# Altium schematic sheet bridge.SchDoc
size A2; SheetNumber: 2; SheetTotal: 5
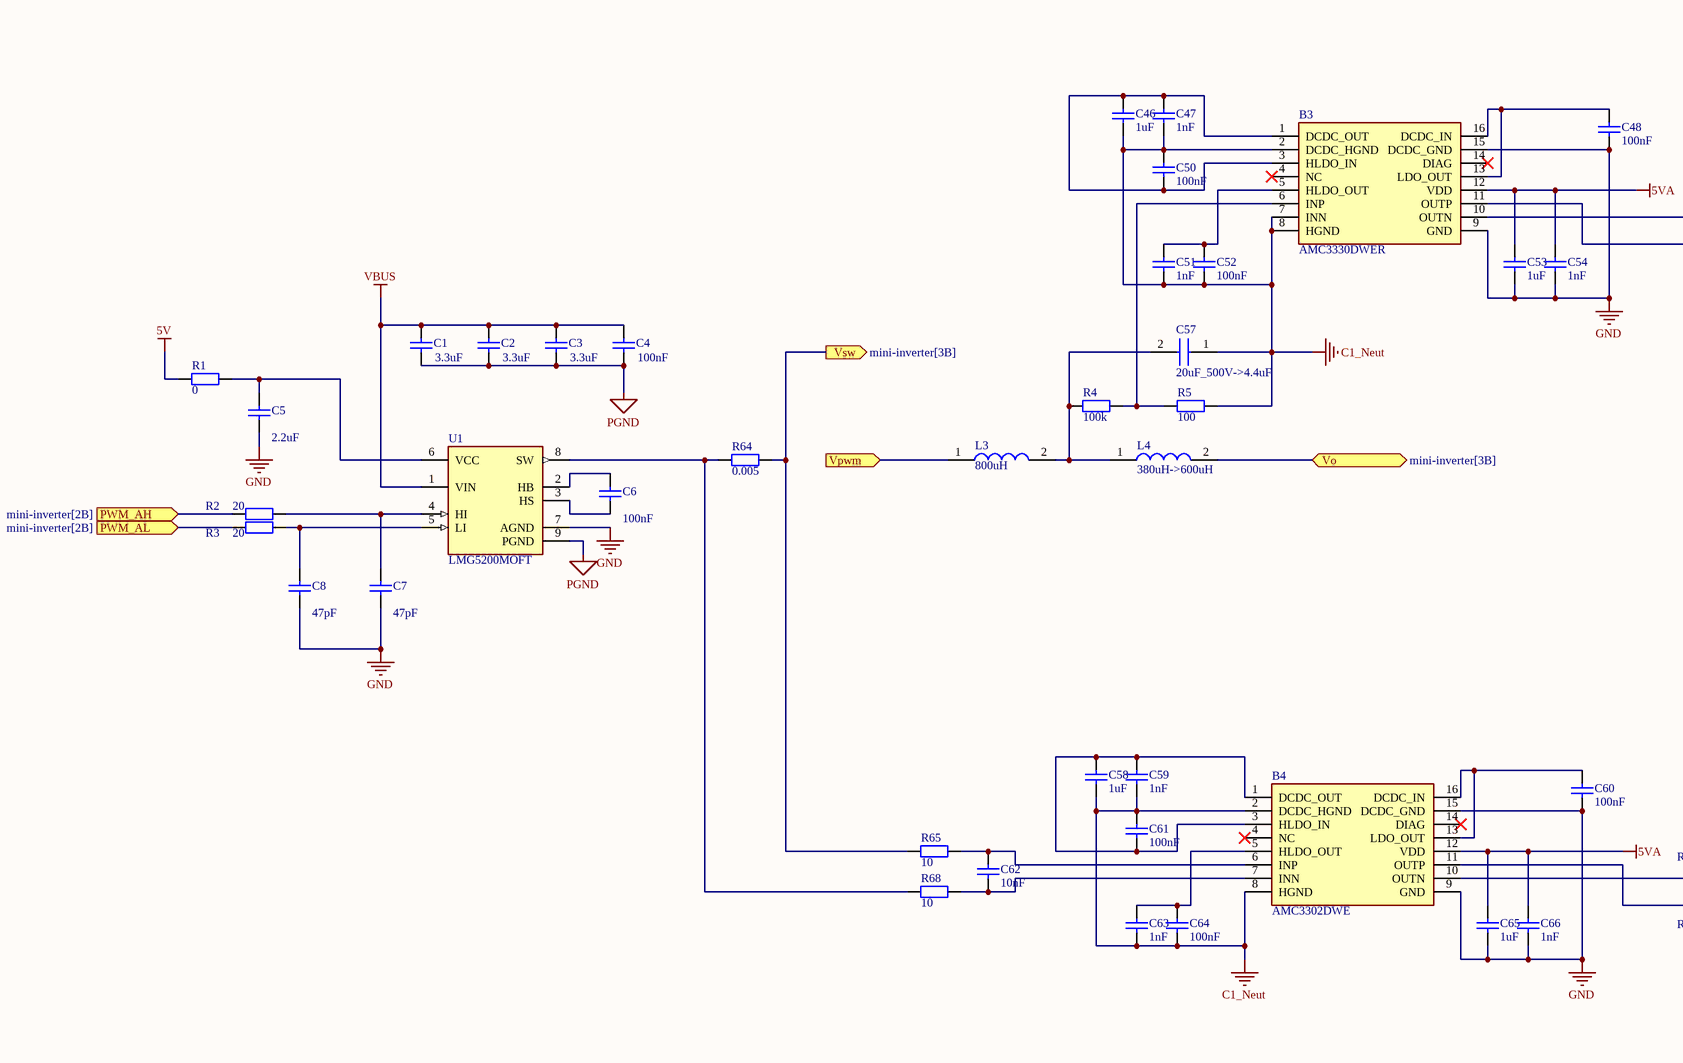
[diagram p0: bridge.SchDoc, left]
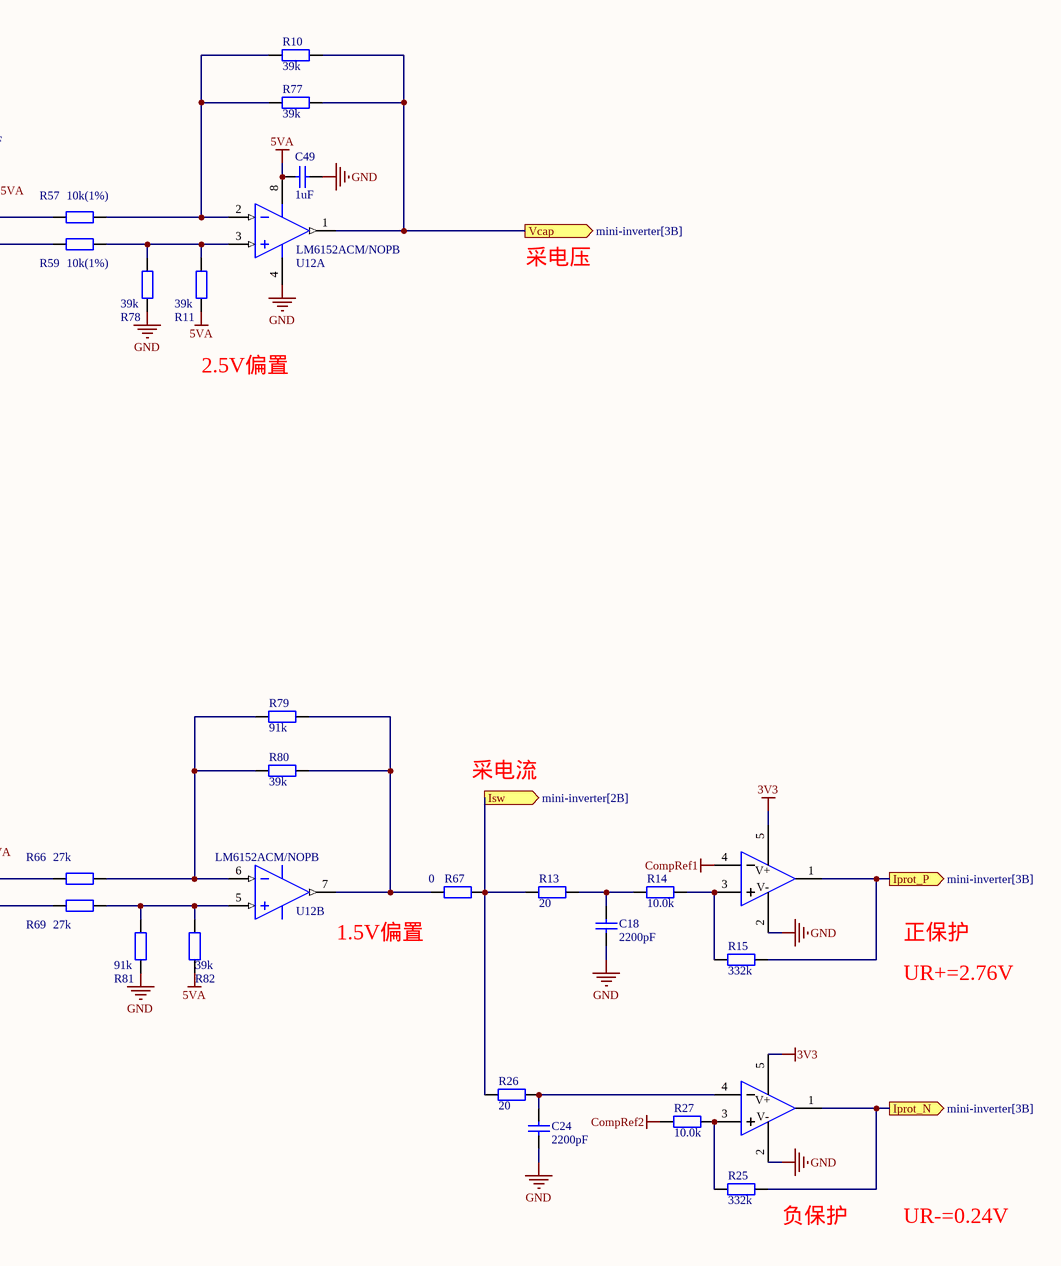
[diagram p1: bridge.SchDoc, right]

## Parts
B3  AMC3330DWER  [SOIC127P1030X265-16N]
B4  AMC3302DWE  [SOIC127P1030X265-16N]
C1  3.3uF  [CAPC1608X06N]
C2  3.3uF  [CAPC1608X06N]
C3  3.3uF  [CAPC1608X06N]
C4  100nF  [CAPC1608X06N]
C5  2.2uF  [CAPC1608X06N]
C6  100nF  [CAPC1608X06N]
C7  47pF  [CAPC1608X06N]
C8  47pF  [CAPC1608X06N]
C18  2200pF  [CAPC1608X06N]
C24  2200pF  [CAPC1608X06N]
C46  1uF  [CAPC1608X06N]
C47  1nF  [CAPC1608X06N]
C48  100nF  [CAPC1608X06N]
C49  1uF  [CAPC1608X06N]
C50  100nF  [CAPC1608X06N]
C51  1nF  [CAPC1608X06N]
C52  100nF  [CAPC1608X06N]
C53  1uF  [CAPC1608X06N]
C54  1nF  [CAPC1608X06N]
C57  20uF_500V->4.4uF  [Film Capacitor PHE450HF7220JR06L2]
C58  1uF  [CAPC1608X06N]
C59  1nF  [CAPC1608X06N]
C60  100nF  [CAPC1608X06N]
C61  100nF  [CAPC1608X06N]
C62  10nF  [CAPC1608X06N]
C63  1nF  [CAPC1608X06N]
C64  100nF  [CAPC1608X06N]
C65  1uF  [CAPC1608X06N]
C66  1nF  [CAPC1608X06N]
L3  800uH  [4mH Custom]
L4  380uH->600uH  [380uH Custom]
R1  0  [RESC1608X05N]
R2  20  [RESC1608X05N]
R3  20  [RESC1608X05N]
R4  100k  [RESC1608X05N]
R5  100  [RESC1608X05N]
R10  39k  [RESC1608X05N]
R11  39k  [RESC1608X05N]
R13  20  [RESC1608X05N]
R14  10.0k  [RESC1608X05N]
R15  332k  [RESC1608X05N]
R25  332k  [RESC1608X05N]
R26  20  [RESC1608X05N]
R27  10.0k  [RESC1608X05N]
R57  10k(1%)  [RESC1608X05N]
R59  10k(1%)  [RESC1608X05N]
R64  0.005  [RESC1608X05N]
R65  10  [RESC1608X05N]
R66  27k  [RESC1608X05N]
R67  0  [RESC1608X05N]
R68  10  [RESC1608X05N]
R69  27k  [RESC1608X05N]
R77  39k  [RESC1608X05N]
R78  39k  [RESC1608X05N]
R79  91k  [RESC1608X05N]
R80  39k  [RESC1608X05N]
R81  91k  [RESC1608X05N]
R82  39k  [RESC1608X05N]
U1  LMG5200MOFT  [FP-MOF0009A-MFG]
U5  TLV3201AIDBVR  [SOT-23-5_L3.0-W1.7-P0.95-LS2.8-BR]  (value not drawn)
U7  TLV3201AIDBVR  [SOT-23-5_L3.0-W1.7-P0.95-LS2.8-BR]  (value not drawn)
U12  LM6152ACM/NOPB  [D0008A_L]  (parts A,B of 2)

## Ports
Iprot_N (out, see mini-inverter[3B]), Iprot_P (out, see mini-inverter[3B]), Isw (out, see mini-inverter[2B]), PWM_AH (in, see mini-inverter[2B]), PWM_AL (in, see mini-inverter[2B]), Vcap (out, see mini-inverter[3B]), Vo (bidir, see mini-inverter[3B]), Vpwm (in), Vsw (out, see mini-inverter[3B])

## Nets
3V3: U5.5(VCC) U7.5(VCC)
5V: R1.2
5VA: B3.12(VDD) B4.12(VDD) C49.2 C53.1 C54.1 C65.1 C66.1 R11.1 R82.1 U12.8(V+)
C1_Neut: B3.2(DCDC_HGND) B3.7(INN) B3.8(HGND) B4.2(DCDC_HGND) B4.8(HGND) C46.2 C47.2 C50.1 C51.2 C52.2 C57.1 C58.2 C59.2 C61.1 C63.2 C64.2 R5.2
CompRef1: U5.4(IN-)
CompRef2: R27.2
GND: B3.9(GND) B3.15(DCDC_GND) B4.9(GND) B4.15(DCDC_GND) C5.1 C7.2 C8.2 C18.2 C24.2 C48.2 C49.1 C53.2 C54.2 C60.2 C65.2 C66.2 R78.1 R81.1 U1.7(AGND) U5.2(GND) U7.2(GND) U12.4(V-)
PGND: C1.1 C2.1 C3.1 C4.2 U1.9(PGND)
VBUS: C1.2 C2.2 C3.2 C4.1 U1.1(VIN)
Iprot_N: R25.1 U7.1(OUT) ; port Iprot_N
Iprot_P: R15.1 U5.1(OUT) ; port Iprot_P
Isw: R13.2 R26.2 R67.1 ; port Isw
PWM_AH: R2.2 ; port PWM_AH
PWM_AL: R3.2 ; port PWM_AL
Vcap: R10.1 R77.1 U12.1(OUTA) ; port Vcap
Vo: L4.2 ; port Vo
Vpwm: L3.1 ; port Vpwm
Vsw: R64.2 R65.1 ; port Vsw
NetB3_1: B3.1(DCDC_OUT) B3.3(HLDO_IN) C46.1 C47.1 C50.2
NetB3_5: B3.5(HLDO_OUT) C51.1 C52.1
NetB3_6: B3.6(INP) R4.2 R5.1
NetB3_10: B3.10(OUTN) R57.2
NetB3_11: B3.11(OUTP) R59.1
NetB3_13: B3.13(LDO_OUT) B3.16(DCDC_IN) C48.1
NetB4_1: B4.1(DCDC_OUT) B4.3(HLDO_IN) C58.1 C59.1 C61.2
NetB4_5: B4.5(HLDO_OUT) C63.1 C64.1
NetB4_6: B4.6(INP) C62.1 R65.2
NetB4_7: B4.7(INN) C62.2 R68.2
NetB4_10: B4.10(OUTN) R66.2
NetB4_11: B4.11(OUTP) R69.1
NetB4_13: B4.13(LDO_OUT) B4.16(DCDC_IN) C60.1
NetC5_2: C5.2 R1.1 U1.6(VCC)
NetC6_1: C6.1 U1.2(HB)
NetC6_2: C6.2 U1.3(HS)
NetC7_1: C7.1 R2.1 U1.4(HI)
NetC8_1: C8.1 R3.1 U1.5(LI)
NetC18_1: C18.1 R13.1 R14.2
NetC24_1: C24.1 R26.1 U7.4(IN-)
NetC57_2: C57.2 L3.2 L4.1 R4.1
NetR10_2: R10.2 R57.1 R77.2 U12.2(INA-)
NetR11_2: R11.2 R59.2 R78.2 U12.3(INA+)
NetR14_1: R14.1 R15.2 U5.3(IN+)
NetR25_2: R25.2 R27.1 U7.3(IN+)
NetR64_1: R64.1 R68.1 U1.8(SW)
NetR66_1: R66.1 R79.1 R80.2 U12.6(INB-)
NetR67_2: R67.2 R79.2 R80.1 U12.7(OUTB)
NetR69_2: R69.2 R81.2 R82.2 U12.5(INB+)

Not connected (* = marked no-connect by the designer): B3 4(NC)* 14(DIAG)*; B4 4(NC)* 14(DIAG)*

## Notes on the sheet
- 采电压
- 2.5V偏置
- 采电流
- (near U12) 1.5V偏置
- 正保护
- UR+=2.76V
- (near R25) 负保护
- UR-=0.24V
- (in symbol TLV3201AIDBVR) V+; V-

## Library data of the parts
B3 = AMC3330DWER: Isolation Amplifiers +/-1-V input, precision reinforced isolated amplifier with integrated DC/DC converter and high CMTI 16-SOIC -40 to 125; Manufacturer_Name: Texas Instruments; Geometry.Height: 2.65mm; Manufacturer_Part_Number: AMC3330DWER; Mouser Part Number: 595-AMC3330DWER; Mouser Price/Stock: https://www.mouser.co.uk/ProductDetail/Texas-Instruments/AMC3330DWER?qs=zW32dvEIR3u5qLqnY17MoA%3D%3D; Arrow Part Number: AMC3330DWER; Arrow Price/Stock: https://www.arrow.com/en/products/amc3330dwer/texas-instruments?region=nac; Datasheet Link: https://www.ti.com/lit/ds/symlink/amc3330.pdf?ts=1627904955935&ref_url=https%253A%252F%252Fwww.ti.com%252Fproduct%252FAMC3330
B4 = AMC3302DWE: Isolation Amplifiers +/-50-mV input, precision reinforced isolated amplifier with integrated DC/DC converter 16-SOIC -40 to 125; Manufacturer_Name: Texas Instruments; Geometry.Height: 2.65mm; Manufacturer_Part_Number: AMC3302DWE; Mouser Part Number: 595-AMC3302DWE; Mouser Price/Stock: https://www.mouser.co.uk/ProductDetail/Texas-Instruments/AMC3302DWE?qs=DRkmTr78QAT3OfY8Rd%252BeWA%3D%3D; Arrow Part Number: AMC3302DWE; Arrow Price/Stock: https://www.arrow.com/en/products/amc3302dwe/texas-instruments?region=nac; Datasheet Link: https://www.ti.com/lit/ds/symlink/amc3302.pdf?ts=1643366130509
C1-C8 C18 C24 C46-C54 C58-C66 = Cap: Capacitor; Published: 8-Jun-2000; LatestRevisionDate: 17-Jul-2002; LatestRevisionNote: Re-released for DXP Platform.; PackageReference: RAD-0.3; Publisher: Altium Limited; PackageDescription: Radial Cap, Thru-Hole; 2 Leads; 0.3 in Pin Spacing
  C1-C3: Value: 3.3uF
  C4 C6 C48 C50 C52 C60 C61 C64: Value: 100nF
  C5: Value: 2.2uF
  C7 C8: Value: 47pF
  C18 C24: Value: 2200pF
  C46 C49 C53 C58 C65: Value: 1uF
  C47 C51 C54 C59 C63 C66: Value: 1nF
  C62: Value: 10nF
C57 = PHE450HF7220JR06L2: KEMET PHE450 Metallised Polypropylene Film Capacitor, 180 V ac, 250 V dc, ±5%, 2.2μF, Through Hole; Datasheet Link: https://docs.rs-online.com/a458/0900766b817170df.pdf; Height: 24.5mm; Manufacturer_Name: KEMET; Manufacturer_Part_Number: PHE450HF7220JR06L2
L3 = 4mH Custom Inductor
L4 = 380uH Custom Inductor
R1-R5 R13-R15 R25-R27 R64 R65 R68 = 0603 100KΩ (1003) 1%_4: 贴片电阻; Value: 1MΩ(1%); ComponentLink1Description: 供应商链接; ComponentLink1URL: http://www.szlcsc.com/product/details_26546.html; Package: 0603; Supplier: LC; SuppliersPartNumber: C25803
R10 R11 R57 R59 R67 R77-R82 = Res2: Resistor; Published: 8-Jun-2000; LatestRevisionDate: 17-Jul-2002; LatestRevisionNote: Re-released for DXP Platform.; PackageReference: AXIAL-0.4; Publisher: Altium Limited; PackageDescription: Axial Device, Thru-Hole; 2 Leads; 0.4 in Pin Spacing
  R10 R11 R77 R78 R80 R82: Value: 39k
  R57 R59: Value: 10k(1%)
  R67: Value: 0
  R79 R81: Value: 91k
R66 R69 = Res2: Resistor; Value: 10k(1%); Published: 8-Jun-2000; LatestRevisionDate: 17-Jul-2002; LatestRevisionNote: Re-released for DXP Platform.; PackageReference: AXIAL-0.4; Publisher: Altium Limited; PackageDescription: Axial Device, Thru-Hole; 2 Leads; 0.4 in Pin Spacing
U1 = CMP-04912-000022-2: None; Output Current per Channel: 10A; Interface: Logic; Min Operating Temperature: -40°C; Mount: Surface Mount; Case/Package: QFN; RoHS Compliant: Yes; Packaging: Cut Tape; Max Operating Temperature: 125°C; Number of Pins: 9
U5 U7 = TLV3201AIDBVR: Manufacturer: TI(德州仪器); Add into BOM: yes; Input Offset Voltage (Vos): 1mV; Input Bias Current (Ib): 5nA; Propagation Delay Time: 40ns; Input Hysteresis Voltage (Vhys): 1.2mV; Common Mode Rejection Ratio (CMRR): 70dB; Supply Voltage: 2.7V~5.5V; Output Type: 推挽; Supply Current: 40uA; Symbol: TLV3201AIDBVR; Device: TLV3201AIDBVR; LCSC Part Name: TLV3201AIDBVR; Supplier Part: C105188; Manufacturer Part: TLV3201AIDBVR; Supplier Footprint: SOT-23-5; JLCPCB Part Class: Extended Part; Datasheet: https://www.ti.com/cn/lit/gpn/tlv3201; Supplier: LCSC; Convert to PCB: yes; Output Mode: -; Rail-to-Rail: -; Operating Temperature: -40℃~+125℃
U12 = LM6152ACM/NOPB: Dual and Quad 75 MHz GBW Rail-to-Rail I/O Operational Amplifiers, 8-pin Narrow SOIC, Pb-Free; Manufacturer: Texas Instruments; PackageTopMarking: NSZXTT*LM61*52ACM; PowerWise: Y; Package Reference: D0008A; Code_JEDEC: MS-012-AA; Code_IPC: SOIC127P600-8; PinCount: 8; ComponentLink1URL: http://www.ti.com/general/docs/lit/getliterature.tsp?genericPartNumber=LM6152&fileType=pdf; PackageDescription: SOIC Narrow, 4.9 x 3.9 x 1.45mm, 8 Lead, 1.27mm Pitch; CompType: Amplifiers; RoHS: Y; ComponentLink1Description: Datasheet URL